# Altium schematic sheet usb-cuter.SchDoc
size A3; SPICEModelCacheRLVYLVLF: <root> / <DocumentId>RLVYLVLF</DocumentId> / <CacheFrame Number="0"> / <Model Name="qnpn" Kind="MDL"> / <Text>*QNPN / *NPN Trans Pinout: C,B,E / .MODEL QNPN NPN(IS=3.2E-16 BF=141 VAF=35 ISE=2.6 NE=1.46 CJE=1E-13 / + MJE=0.333 TF=6E-11 CJC=1E-13 CJS=2.2E-13 MJS=0.5 FC=0.67 )</Text> / </Model> / </CacheFrame> / </root>
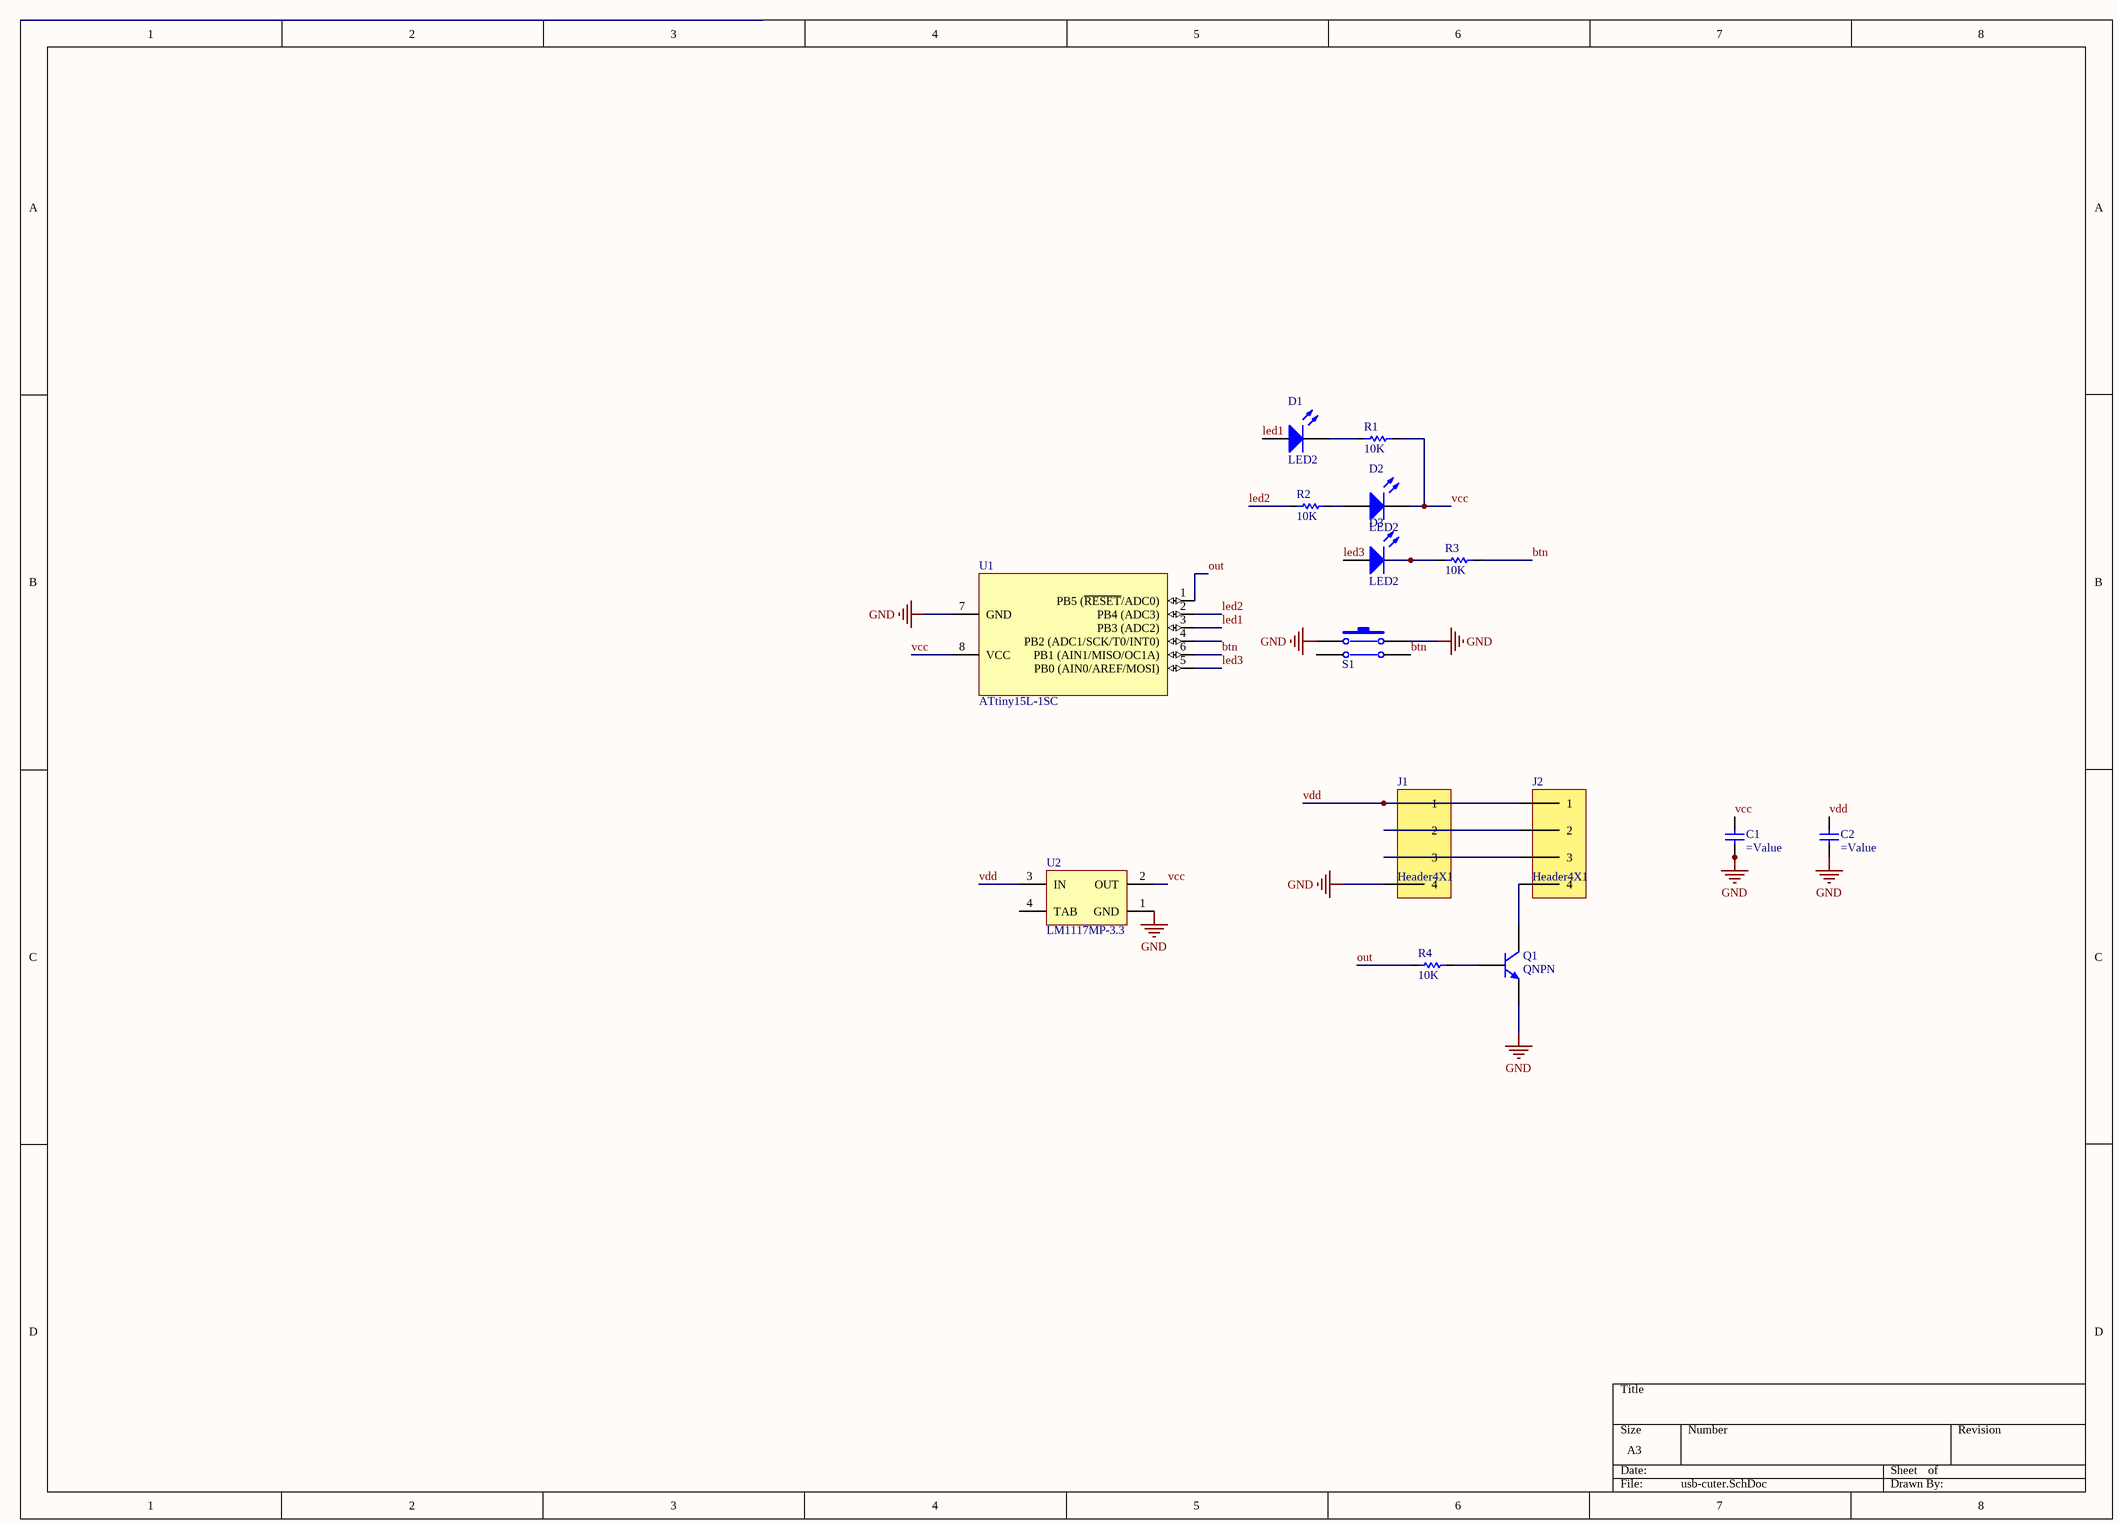
[diagram p0: usb-cuter.SchDoc]

## Parts
C1  (no value)  [CAP 0805]
C2  (no value)  [CAP 0805]
D1  LED2  [3.2X1.6X1.1]
D2  LED2  [3.2X1.6X1.1]
D3  LED2  [3.2X1.6X1.1]
J1  Header4X1  [HEADER 4X1]
J2  Header4X1  [HEADER 4X1]
Q1  QNPN  [SOT-23B_L]
R1  10K  [RES 0805 (2012X06L)]
R2  10K  [RES 0805 (2012X06L)]
R3  10K  [RES 0805 (2012X06L)]
R4  10K  [RES 0805 (2012X06L)]
S1  PUSH BUTTON DOUBLE  [PUSH BUTTON]  (value not drawn)
U1  ATtiny15L-1SC  [8S2_N]
U2  LM1117MP-3.3  [SOT89L]

## Nets
GND: C1.1(+) C2.1(+) J1.4 Q1.3(E) S1.1 S1.2 U1.7(GND) U2.1(GND)
btn: R3.2 S1.4 U1.6(PB1_(AIN1/MISO/OC1A))
led1: D1.1(A) U1.3(PB3_(ADC2))
led2: R2.2 U1.2(PB4_(ADC3))
led3: D3.1(A) U1.5(PB0_(AIN0/AREF/MOSI))
out: R4.1 U1.1(PB5_(~{RESET}/ADC0))
vcc: C1.2(-) D2.2(K) R1.1 U1.8(VCC) U2.2(OUT)
vdd: C2.2(-) J1.1 J2.1 U2.3(IN)
NetD1_2: D1.2(K) R1.2
NetD2_1: D2.1(A) R2.1
NetD3_2: D3.2(K) R3.1
NetJ1_2: J1.2 J2.2
NetJ1_3: J1.3 J2.3
NetJ2_4: J2.4 Q1.1(C)
NetQ1_2: Q1.2(B) R4.2

Not connected (* = marked no-connect by the designer): S1 3; U1 4(PB2_(ADC1/SCK/T0/INT0)); U2 4(TAB)

## Library data of the parts
C1 C2 = Capacitor
D1-D3 = LED2: Typical RED, GREEN, YELLOW, AMBER GaAs LED; Published: 8-Jun-2000; LatestRevisionDate: 17-Jul-2002; LatestRevisionNote: Re-released for DXP Platform.; PackageVersion: Feb-2002; PackageReference: 3.2X1.6X1.1; Publisher: Altium Limited; PackageDescription: SM LED; 2 Flat Leads
Q1 = QNPN: NPN Bipolar Transistor; pin to pad: 1>3 2>1 3>2; Published: 8-Jun-2000; LatestRevisionDate: 29-May-2009; LatestRevisionNote: IPC-7351 Footprint Added.; PackageVersion: Aug-1999; PackageReference: SOT-23B; Publisher: Altium Limited; PackageDescription: 3-Pin SOT-23 Package 0.95 mm Pitch, 2.4 mm Lead Span
R1-R4 = Resistor: Tolerance: 5%; Power: 1/4 W; Value: 10K
S1 = PUSH BUTTON DOUBLE: Switch
U1 = ATtiny15L-1SC: 8-Bit AVR Microcontroller with 1K Byte of Flash Memory; pin to pad: 1>7 7>8 8>1; Published: 17-Sep-2003; LatestRevisionDate: 16-Oct-2006; LatestRevisionNote: IPC-7351 Footprint Added.; DatasheetVersion: 1187E-AVR-06/02; PackageVersion: revF, Apr-2008; PackageReference: 8S2; Publisher: Altium Limited; PackageDescription: 8-Lead, 0.208" Body, Plastic Small Outline Package (EIAJ); Supplier 1: Digi-Key; Supplier Part Number 1: ATTINY15L-1SC-ND; Supplier 2: Mouser; Supplier Part Number 2: 556-ATTINY15L1SC; ComponentLink1Description: Datasheet; ComponentLink1URL: http://www.atmel.com/dyn/resources/prod_documents/doc1187.pdf; ComponentLink2Description: Atmel.com Home; ComponentLink2URL: http://www.atmel.com
U2 = LM1117MP-3.3: 800mA Low-Dropout Linear Regulator; pin to pad: 1>2 2>1; Manufacturer: National Semiconductor; CompType: LDO IC; PackageTopMarking: XYTT*N05A; PowerWise: N; Published: 4-Dec-2008; DatasheetVersion: Apr-2006; PackageVersion: revB, Apr-2003; PackageReference: MP04A; Publisher: Altium Limited; PackageDescription: Molded SOT-223, 6.50 x 3.56 x 1.6mm Body, 4 Lead, 2.3mm Pitch; PartNumber: LM1117MP-3.3; RoHS: O; PinCount: 4; DigiKeyPartNumber: LM1117MP-3.3CT-ND; Code_JEDEC: TO-261-AA; Code_IPC: SOT223-4; ComponentLink1Description: LM1117 Datasheet; ComponentLink1URL: http://www.national.com/ds/LM/LM1117.pdf; ComponentLink2Description: LM1117 Web Page; ComponentLink2URL: http://www.national.com/pf/LM/LM1117.html; ComponentLink3Description: MP04A Package Page; ComponentLink3URL: http://www.national.com/packaging/folders/mp04a.html